# EAGLE design top (EAGLE 9.4.2)
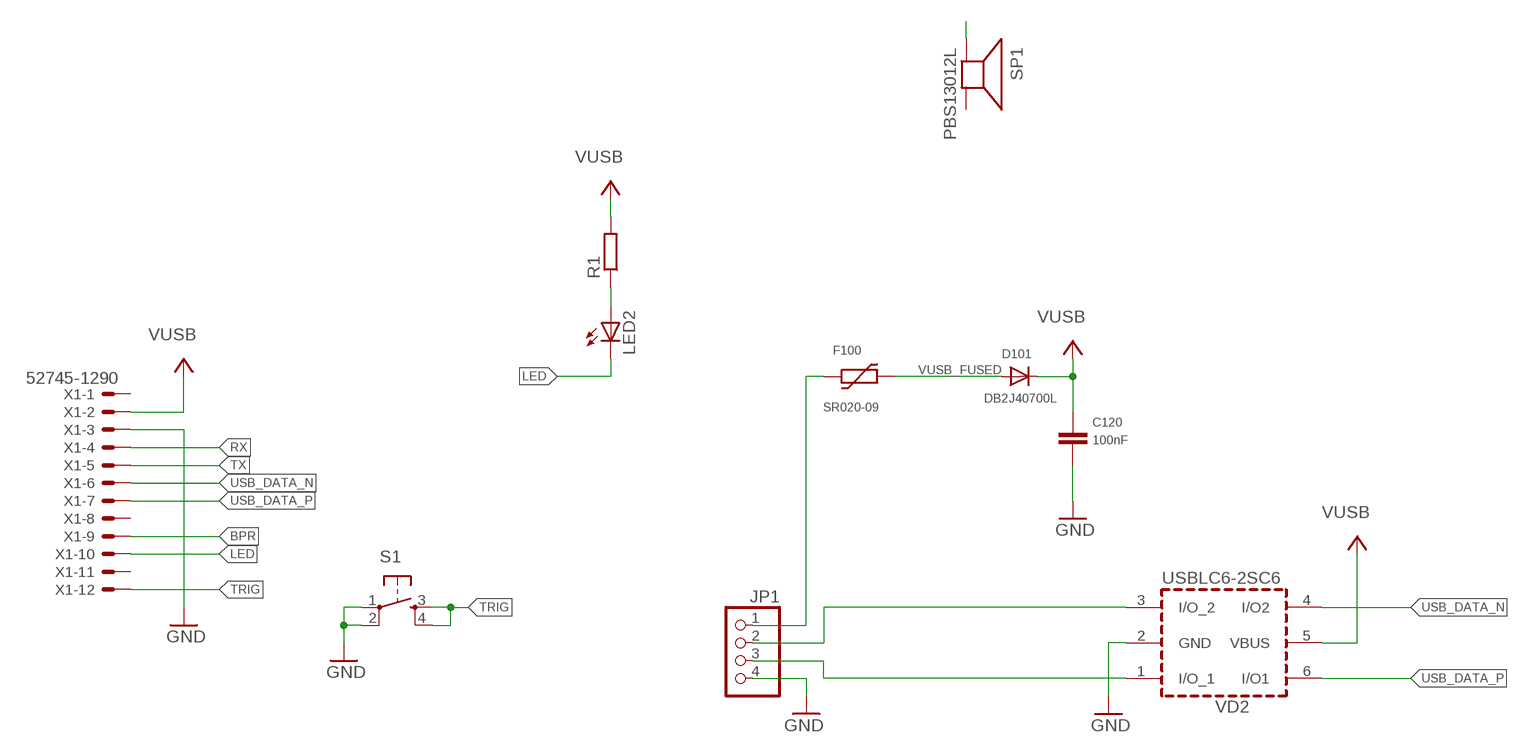
[diagram p0: schematic, sheet 1]

## Parts
C120  100nF  C-EUC0603K  [C0603K]
D101  DB2J40700L  DIODESOD-323F  [SOD-323F]
F100  SR020-09  FUSE_PTC-0805  [PTC0805]
JP1  PINHD-1X4  [1X04]
LED2  LEDCHIP-LED0805  [CHIP-LED0805]
R1  R-EU_R0603  [R0603]
S1  TAC_SWITCHSMD  [TACTILE_SWITCH_SMD]
SP1  PBS13012L  SPEAKER/AL60P  [AL60P]
VD2  USBLC6-2SC6  [SOT-23-6L]
X1  52745-1290  [52745-1290]

## Nets
BPR: X1.9
BUZZER_PLUS: SP1.1(+)
GND: C120.2 JP1.4 S1.1 S1.2 VD2.2(GND) X1.3
LED: LED2.C X1.10
N$1: LED2.A R1.1
RX: X1.4
TRIG: S1.3 S1.4 X1.12
TX: X1.5
USB_DATA_N: VD2.4(I/O2) X1.6
USB_DATA_P: VD2.6(I/O1) X1.7
USB_DATA_UNPROT_N: JP1.2 VD2.3(I/O_2)
USB_DATA_UNPROT_P: JP1.3 VD2.1(I/O_1)
VUSB: C120.1 D101.C R1.2 VD2.5(VBUS) X1.2
VUSB_FUSED: D101.A F100.2
VUSB_UNPROT: F100.1 JP1.1
Unconnected: SP1.2(-) X1.1 X1.8 X1.11

## Library data of the parts
C120 = rcl:C-EU: CAPACITOR, European symbol; OC_LOMEX: 82-06-23; OC_TME: CL10F104ZB8NNNC
D101 = adafruit:DIODE: Diode SMADIODE - SMA Surface Mount Package 20V 1A Schottky Diode Digikey: 641-1014-6-ND DO-1N4148 - Through Hole Small Current Diode SOD-123 20V 1 A (.5mV Vf) Schottky Diode - Digikey: MBRX120TPMSCT-ND SOD-323 10V 570mA (.38mV Vf, 3ns) Schottky Diode - Digikey: ZLLS410CT-ND SOD-523 30V 30mA Schottky Diode (RB751S-40TE61) - Digikey: RB751S-40TE61CT-ND SOT23-R/W - SOT23 Package (R = Solder Paste/Reflow Ovens, W = Hand-Soldering) BAT54Film 40V 300mA - Digikey: 497-7162-1-ND; OC_FARNELL: 2284945; OC_TME: PMEG1030EJ.115
F100 = dp_devices:FUSE_PTC: Resettable PTC; OC_TME: SR020-09
JP1 = pinhead:PINHD-1X4: PIN HEADER
LED2 = adafruit:LED: LED OSRAM: - CHIPLED LG R971, LG N971, LY N971, LG Q971, LY Q971, LO R971, LY R971 LH N974, LH R974 LS Q976, LO Q976, LY Q976 LO Q996 - Hyper CHIPLED LW Q18S LB Q993, LB Q99A, LB R99A - SideLED LS A670, LO A670, LY A670, LG A670, LP A670 LB A673, LV A673, LT A673, LW A673 LH A674 LY A675 LS A676, LA A676, LO A676, LY A676, LW A676 LS A679, LY A679, LG A679 - Hyper Micro SIDELED® LS Y876, LA Y876, LO Y876, LY Y876 LT Y87S - SmartLED LW L88C, LW L88S LB L89C, LB L89S, LG L890 LS L89K, LO L89K, LY L89K LS L896, LA L896, LO L896, LY L896 - TOPLED LS T670, LO T670, LY T670, LG T670, LP T670 LSG T670, LSP T670, LSY T670, LOP T670, LYG T670 LG T671, LOG T671, LSG T671 LB T673, LV T673, LT T673, LW T673 LH T674 LS T676, LA T676, LO T676, LY T676, LB T676, LH T676, LSB T676, LW T676 LB T67C, LV T67C, LT T67C, LS T67K, LO T67K, LY T67K, LW E67C LS E67B, LA E67B, LO E67B, LY E67B, LB E67C, LV E67C, LT E67C LW T67C LS T679, LY T679, LG T679 LS T770, LO T770, LY T770, LG T770, LP T770 LB T773, LV T773, LT T773, LW T773 LH T774 LS E675, LA E675, LY E675, LS T675 LS T776, LA T776, LO T776, LY T776, LB T776 LHGB T686 LT T68C, LB T68C - Hyper Mini TOPLED® LB M676 - Mini TOPLED Santana® LG M470 LS M47K, LO M47K, LY M47K Source: http://www.osram.convergy.de/
R1 = rcl:R-EU_: RESISTOR, European symbol
S1 = SparkFun:TAC_SWITCH: Momentary Switch Button commonly used for reset or general input. Spark Fun Electronics SKU : COM-00097
SP1 = adafruit:SPEAKER: SPEAKER Source: Buerklin Added PS12 (for part # PS1240 piezo) http://www.ladyada.net/library/pcb/eaglelibrary.html; OC_LOMEX: 46-02-60
VD2 = usblc6:USBLC6-2: VERY LOW CAPACITANCE ESD PROTECTION 2 line Datasheet link <http://www.st.com/web/catalog/sense_power/FM114/CL1137/SC1489/PF93353>; OC_HQ: USBLC6-2SC6
X1 = con-molex:52745-1290: FFC/FPC-to-Board 0.50mm (.020") SMT Top Contact Right Angle, ZIF, Style Receptacle 52745 / 52435 Source: http://www.molex.com/product/ffc/52745.html; MPN: 52745-1290; OC_FARNELL: unknown; OC_NEWARK: 92M6383

## Net classes
0 default: width 0.203 mm

## Board
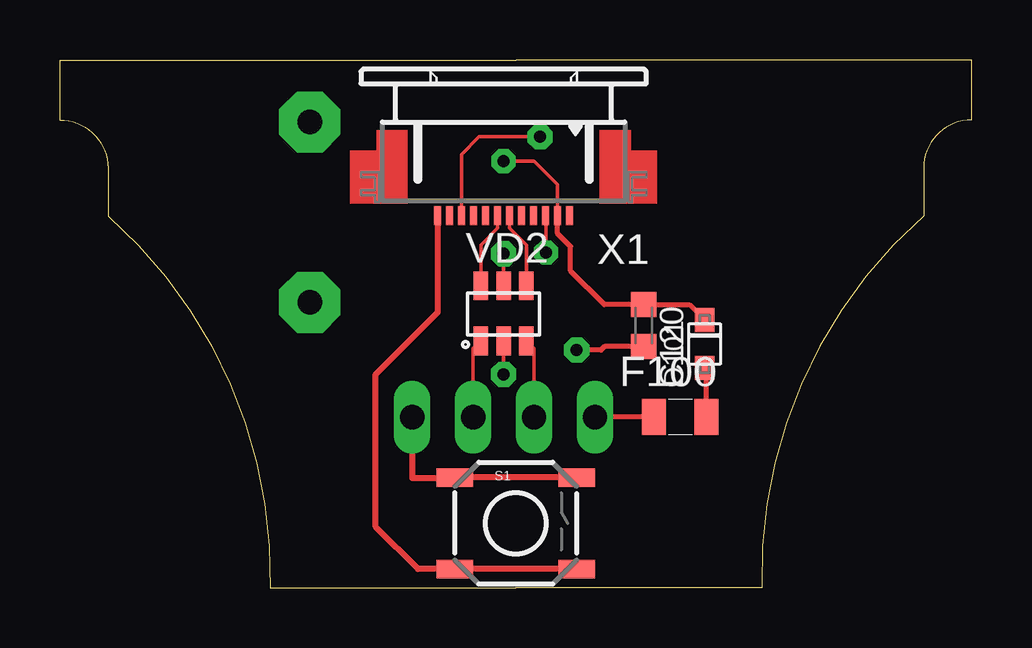
[diagram p1: board, top side]
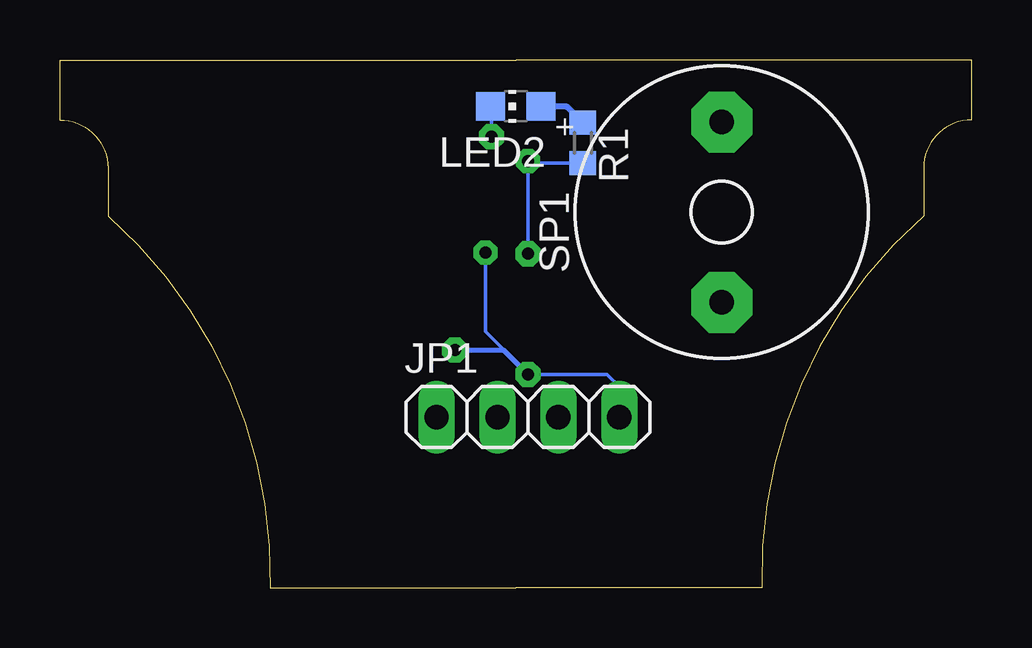
[diagram p2: board, bottom side, seen from below]

Size 38 x 22 mm. Coordinates in mm from the lower left corner, seen from the top.
Outline: 8.75,0 19,0 29.25,0 arc-50 36,15.5 36,17.5 arc-90 38,19.5 38,22 19,22 0,22 0,19.5 arc-90 2,17.5 2,15.5 arc-50 8.75,0
Copper layers (1*16): Top 0.035mm / dielectric 1.5mm / Bottom 0.035mm
Design rules "dirt_cheap_dirty_boards.v1": minimum track width 5mil, minimum drill 0.3mm, track to track 6mil, track to pad 6mil, pad to pad 6mil, via to via 6mil, smd to smd 0mil, copper to edge 10mil, drill to drill 10mil, minimum pad ring 10mil, minimum via ring 6mil, stop-mask expansion 2mil, vias tented up to drill 25mil, thermal gap 10mil

### Footprints (pad centres in the part's own frame; a part is rotated, then mirrored left to right if it is on the bottom)
C0603K = smd 1.05 x 1.08: 1 -0.875,0; 2 0.875,0
SOD-323F = smd 1 x 0.8: A -1,0; C 1,0
PTC0805 = smd 1 x 1.5: 1 -1.1,0; 2 1.1,0
1X04 = drill 1.016 long: 1 -3.81,0; 2 -1.27,0; 3 1.27,0; 4 3.81,0
CHIP-LED0805 = smd 1.2 x 1.2: A 0,-1.05; C 0,1.05
R0603 = smd 1 x 1.1: 1 -0.85,0; 2 0.85,0
TACTILE_SWITCH_SMD = smd 1.524 x 0.762: 1 -2.54,1.905; 2 2.54,1.905; 3 -2.54,-1.905; 4 2.54,-1.905
AL60P = drill 1.016 pad 2.54 octagon: 1 -3.759,0; 2 3.759,0
SOT-23-6L = smd 0.6 x 1.2: 1 -0.95,-1.15; 2 0,-1.15; 3 0.95,-1.15; 4 0.95,1.15; 5 0,1.15; 6 -0.95,1.15
52745-1290 = smd 0.3 x 0.8: 1 -2.75,2.5; 2 -2.25,2.5; 3 -1.75,2.5; 4 -1.25,2.5; 5 -0.75,2.5; 6 -0.25,2.5; 7 0.25,2.5; 8 0.75,2.5; 9 1.25,2.5; 10 1.75,2.5; 11 2.25,2.5; 12 2.75,2.5

### Placement (x,y rotation side)
C120  24.33,10.92 270 top
D101  26.87,10.16 90 top
F100  25.86,7.11 0 top
JP1  18.49,7.11 0 bottom
LED2  19,20.07 90 bottom
R1  16.21,18.54 270 bottom
S1  19,2.68 0 top
SP1  10.41,15.65 90 bottom
VD2  18.49,11.43 0 top
X1  18.49,18.02 180 top

### Tracks (layer width: path | path; a pad name or v marks a point on that pad's centre or on a via)
GND  (via drill 0.5 pad 1, 0.5 pad 1.05)
  Top 0.152: VD2.2 18.49,9.14 v18.49,8.89 | v20.27,13.97 20.27,15.49 X1.3
  Top 0.203: C120.2 22.7,10.05 22.56,9.91 v21.54,9.91
  Top 0.254: S1.2 S1.1 16.45,4.57 14.68,4.57 JP1.4
  Bottom 0.152: v20.27,13.97 20.27,10.67 v18.49,8.89 15.19,8.89 14.68,8.38 JP1.4
  Bottom 0.203: v21.54,9.91 19.51,9.91 v18.49,8.89
LED  (via drill 0.5 pad 1.05)
  Top 0.152: X1.10 16.74,18.06 17.48,18.8 v20.02,18.8
  Bottom 0.152: v20.02,18.8 20.02,20.03 LED2.C
N$1
  Bottom 0.254: LED2.A 16.88,20.07 R1.1
TRIG
  Top 0.254: S1.4 S1.3 14.92,0.78 13.16,2.54 13.16,8.89 15.74,11.47 X1.12
USB_DATA_N
  Top 0.152: VD2.4 19.44,14.29 18.74,14.99 X1.6
USB_DATA_P
  Top 0.152: X1.7 18.24,14.99 17.54,14.29 VD2.6
USB_DATA_UNPROT_N
  Top 0.152: VD2.3 19.76,9.96 JP1.2
USB_DATA_UNPROT_P
  Top 0.152: JP1.3 17.22,9.96 VD2.1
VUSB  (via drill 0.5 pad 1, 0.5 pad 1.05)
  Top 0.152: VD2.5 v18.49,13.92 | X1.2 20.74,16.8 19.76,17.78 v18.49,17.78
  Top 0.203: D101.C 26.24,11.8 C120.1 22.7,11.8 21.29,13.21 21.29,14.22 20.74,14.77 X1.2
  Bottom 0.152: R1.2 18.49,17.69 | 18.49,17.69 v18.49,13.92 | v18.49,17.78 18.49,17.69
VUSB_FUSED
  Top 0.203: F100.2 26.96,9.08 D101.A
VUSB_UNPROT
  Top 0.203: F100.1 JP1.1